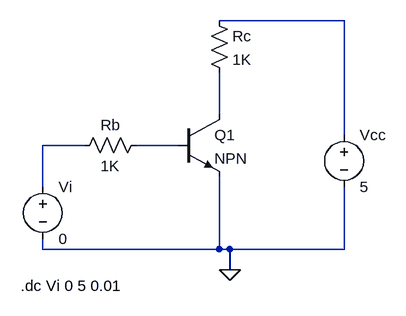
[diagram p0: schematic 1.2.1.asc]
1.2.1.asc, the LTspice schematic file:
Version 4
SHEET 1 880 680
WIRE 432 -80 240 -80
WIRE 240 64 240 0
WIRE 432 96 432 -80
WIRE 32 112 -32 112
WIRE 176 112 112 112
WIRE -32 176 -32 112
WIRE -32 272 -32 256
WIRE 240 272 240 160
WIRE 240 272 -32 272
WIRE 256 272 240 272
WIRE 432 272 432 176
WIRE 432 272 256 272
WIRE 256 304 256 272
FLAG 256 304 0
SYMBOL voltage -32 160 R0
SYMATTR InstName Vi
SYMATTR Value 0
SYMBOL voltage 432 80 R0
SYMATTR InstName Vcc
SYMATTR Value 5
SYMBOL npn 176 64 R0
SYMATTR InstName Q1
SYMBOL res 128 96 R90
WINDOW 0 0 56 VBottom 2
WINDOW 3 32 56 VTop 2
SYMATTR InstName Rb
SYMATTR Value 1K
SYMBOL res 224 -96 R0
SYMATTR InstName Rc
SYMATTR Value 1K
TEXT -66 328 Left 2 !.dc Vi 0 5 0.01

The netlist it stands for:
* 1.2.1.asc
Vi N003 0 0
Vcc N001 0 5
Q1 N002 N004 0 0 NPN
Rb N004 N003 1K
Rc N001 N002 1K
.model NPN NPN
.model PNP PNP
.lib standard.bjt
.dc Vi 0 5 0.01
.backanno
.end